# EAGLE design sHallAdapter (EAGLE 9.6.2)
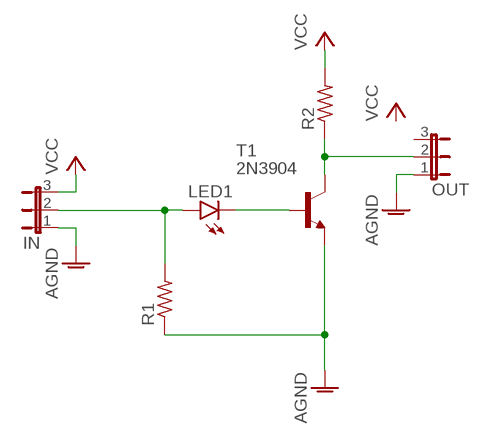
[diagram p0: schematic, sheet 1]

## Parts
IN  JP2E  [JP2]
LED1  LED3MM  [LED3MM]
OUT  JP2E  [JP2]
R1  R-US_R0805W  [R0805W]
R2  R-US_R0805W  [R0805W]
T1  2N3904  [TO92]

## Nets
AGND: IN.1 OUT.1 R1.1 T1.3(E)
N$1: LED1.K(C) T1.2(B)
N$2: IN.2 LED1.A R1.2
N$3: OUT.2 R2.1 T1.1(C)
VCC: IN.3 R2.2
Unconnected: OUT.3

## Library data of the parts
IN OUT = jumper:JP2E: JUMPER
LED1 = led:LED: LED OSRAM: - CHIPLED LG R971, LG N971, LY N971, LG Q971, LY Q971, LO R971, LY R971 LH N974, LH R974 LS Q976, LO Q976, LY Q976 LO Q996 - Hyper CHIPLED LW Q18S LB Q993, LB Q99A, LB R99A - SideLED LS A670, LO A670, LY A670, LG A670, LP A670 LB A673, LV A673, LT A673, LW A673 LH A674 LY A675 LS A676, LA A676, LO A676, LY A676, LW A676 LS A679, LY A679, LG A679 - Hyper Micro SIDELED® LS Y876, LA Y876, LO Y876, LY Y876 LT Y87S - SmartLED LW L88C, LW L88S LB L89C, LB L89S, LG L890 LS L89K, LO L89K, LY L89K LS L896, LA L896, LO L896, LY L896 - TOPLED LS T670, LO T670, LY T670, LG T670, LP T670 LSG T670, LSP T670, LSY T670, LOP T670, LYG T670 LG T671, LOG T671, LSG T671 LB T673, LV T673, LT T673, LW T673 LH T674 LS T676, LA T676, LO T676, LY T676, LB T676, LH T676, LSB T676, LW T676 LB T67C, LV T67C, LT T67C, LS T67K, LO T67K, LY T67K, LW E67C LS E67B, LA E67B, LO E67B, LY E67B, LB E67C, LV E67C, LT E67C LW T67C LS T679, LY T679, LG T679 LS T770, LO T770, LY T770, LG T770, LP T770 LB T773, LV T773, LT T773, LW T773 LH T774 LS E675, LA E675, LY E675, LS T675 LS T776, LA T776, LO T776, LY T776, LB T776 LHGB T686 LT T68C, LB T68C - Hyper Mini TOPLED® LB M676 - Mini TOPLED Santana® LG M470 LS M47K, LO M47K, LY M47K Source: http://www.osram.convergy.de LUXEON: - LUMILED® LXK2-PW12-R00, LXK2-PW12-S00, LXK2-PW14-U00, LXK2-PW14-V00 LXK2-PM12-R00, LXK2-PM12-S00, LXK2-PM14-U00 LXK2-PE12-Q00, LXK2-PE12-R00, LXK2-PE12-S00, LXK2-PE14-T00, LXK2-PE14-U00 LXK2-PB12-K00, LXK2-PB12-L00, LXK2-PB12-M00, LXK2-PB14-N00, LXK2-PB14-P00, LXK2-PB14-Q00 LXK2-PR12-L00, LXK2-PR12-M00, LXK2-PR14-Q00, LXK2-PR14-R00 LXK2-PD12-Q00, LXK2-PD12-R00, LXK2-PD12-S00 LXK2-PH12-R00, LXK2-PH12-S00 LXK2-PL12-P00, LXK2-PL12-Q00, LXK2-PL12-R00 Source: www.luxeon.com KINGBRIGHT: KA-3528ASYC Source: www.kingbright.com
R1 R2 = rcl:R-US_: RESISTOR, American symbol; SPICEPREFIX: R
T1 = transistor:2N3904: NPN TRANSISTOR

## Board
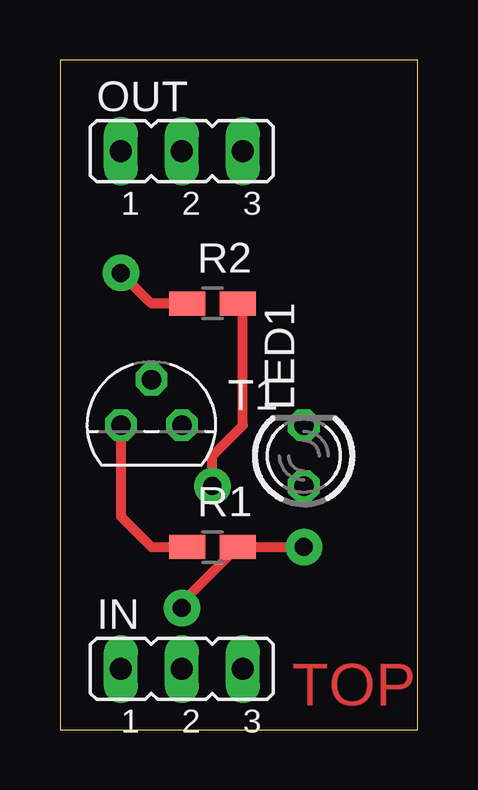
[diagram p1: board, top side]
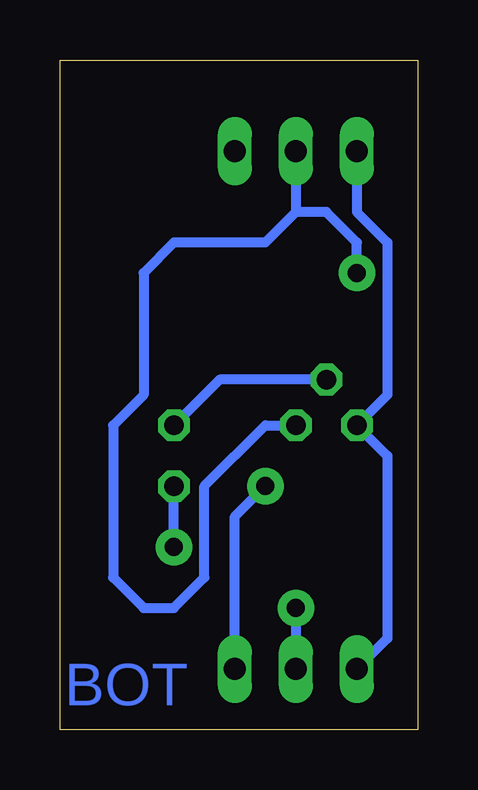
[diagram p2: board, bottom side, seen from below]

Size 14.91 x 27.93 mm. Coordinates in mm from the lower left corner, seen from the top.
Outline: 0,0 14.91,0 14.91,27.93 0,27.93 0,0
Copper layers (1*16): Top 0.035mm / dielectric 1.5mm / Bottom 0.035mm
Design rules "default": minimum track width 6mil, minimum drill 0.35mm, track to track 6mil, track to pad 6mil, pad to pad 6mil, via to via 6mil, smd to smd 6mil, copper to edge 40mil, drill to drill 6mil, minimum pad ring 10mil, minimum via ring 8mil, stop-mask expansion 4mil, vias tented up to drill 0mil, thermal gap 10mil

### Footprints (pad centres in the part's own frame; a part is rotated, then mirrored left to right if it is on the bottom)
JP2 = drill 0.914 long: 1 -2.54,0; 2 0,0; 3 2.54,0
LED3MM = drill 0.813 octagon: A -1.27,0; K 1.27,0
R0805W = smd 1.5 x 1: 1 -1.052,0; 2 1.052,0
TO92 = drill 0.813 octagon: 1 1.27,0; 2 0,1.905; 3 -1.27,0

### Placement (x,y rotation side)
IN  5.08,2.54 0 top
LED1  10.16,11.43 90 top
OUT  5.08,24.13 0 top
R1  6.35,7.62 0 top
R2  6.35,17.78 0 top
T1  3.81,12.7 0 top

### Tracks (layer width: path | path; a pad name or v marks a point on that pad's centre or on a via)
AGND
  Top 0.406: T1.3 2.54,8.89 3.81,7.62 R1.1
  Bottom 0.406: IN.1 1.27,3.81 1.27,11.43 T1.3 1.27,13.97 1.27,20.32 2.54,21.59 OUT.1
N$1
  Bottom 0.406: T1.2 8.25,14.6 LED1.K
N$2  (via drill 0.75 pad 1.52)
  Top 0.406: v10.16,7.62 R1.2 5.08,5.3 v5.08,5.08
  Bottom 0.406: v10.16,7.62 LED1.A | v5.08,5.08 IN.2
N$3  (via drill 0.75 pad 1.52)
  Top 0.406: R2.1 3.81,17.78 v2.54,19.05
  Bottom 0.406: OUT.2 5.08,21.59 | 5.08,21.59 6.35,20.32 10.16,20.32 11.43,19.05 11.43,13.97 12.7,12.7 12.7,6.35 11.43,5.08 10.16,5.08 8.89,6.35 8.89,10.16 6.35,12.7 T1.1 | v2.54,19.05 2.54,20.32 3.81,21.59 5.08,21.59
VCC  (via drill 0.75 pad 1.52)
  Top 0.406: v6.35,10.16 6.35,11.43 7.62,12.7 7.62,17.78 R2.2
  Bottom 0.406: IN.3 7.62,8.89 v6.35,10.16

### Text on the board
Top: TOP
Bottom: BOT